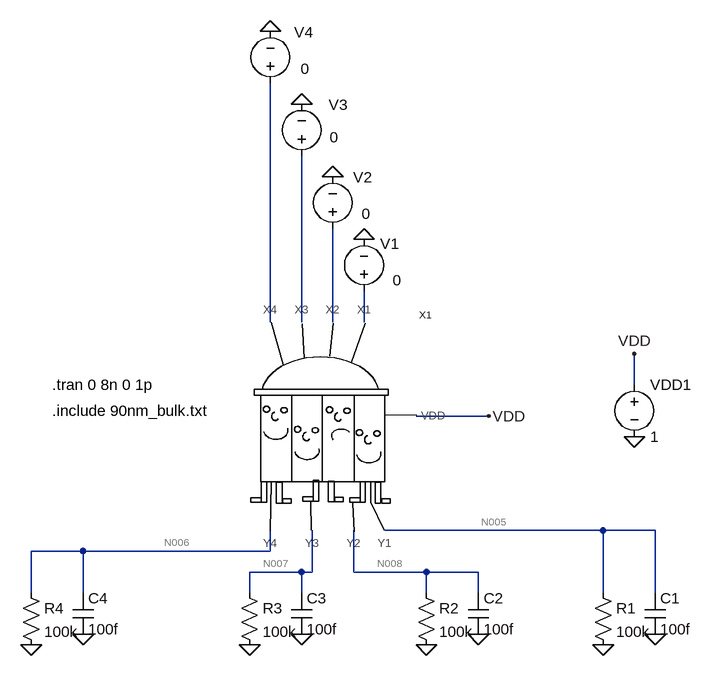
[diagram p0: schematic FUNC_BLOCK_test.asc]
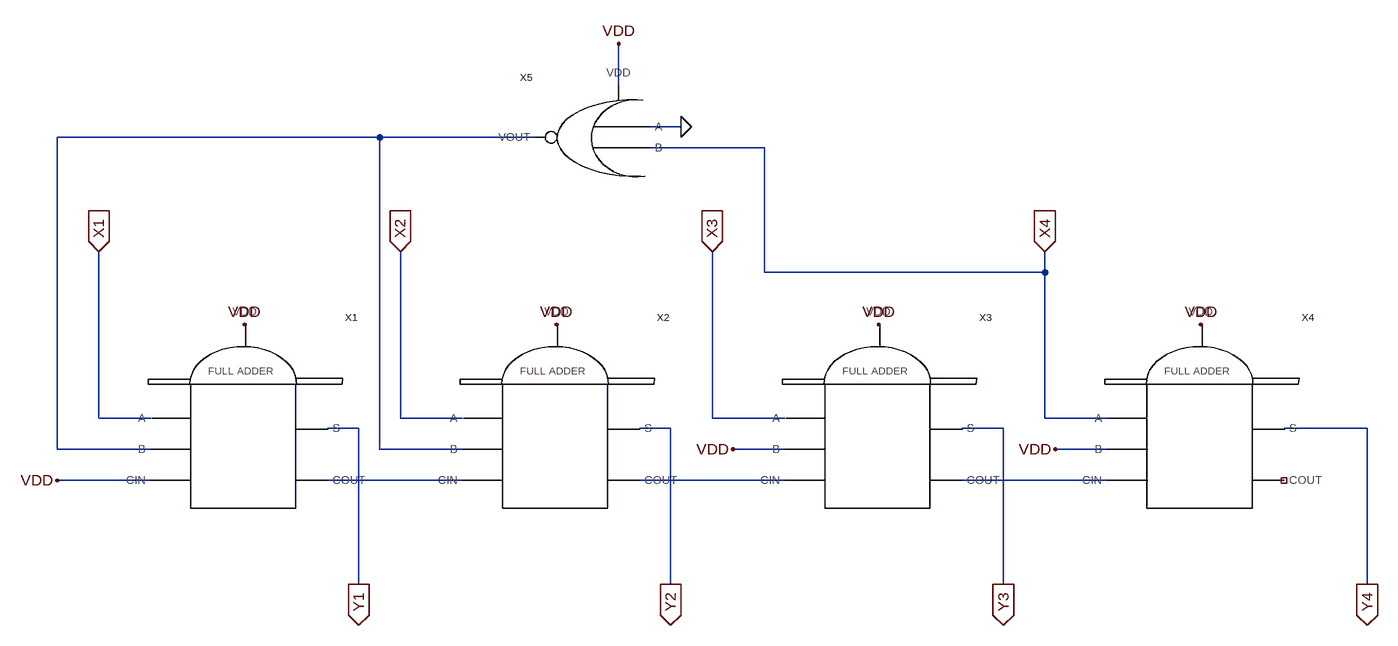
[diagram p1: sub-circuit func_block.asc]
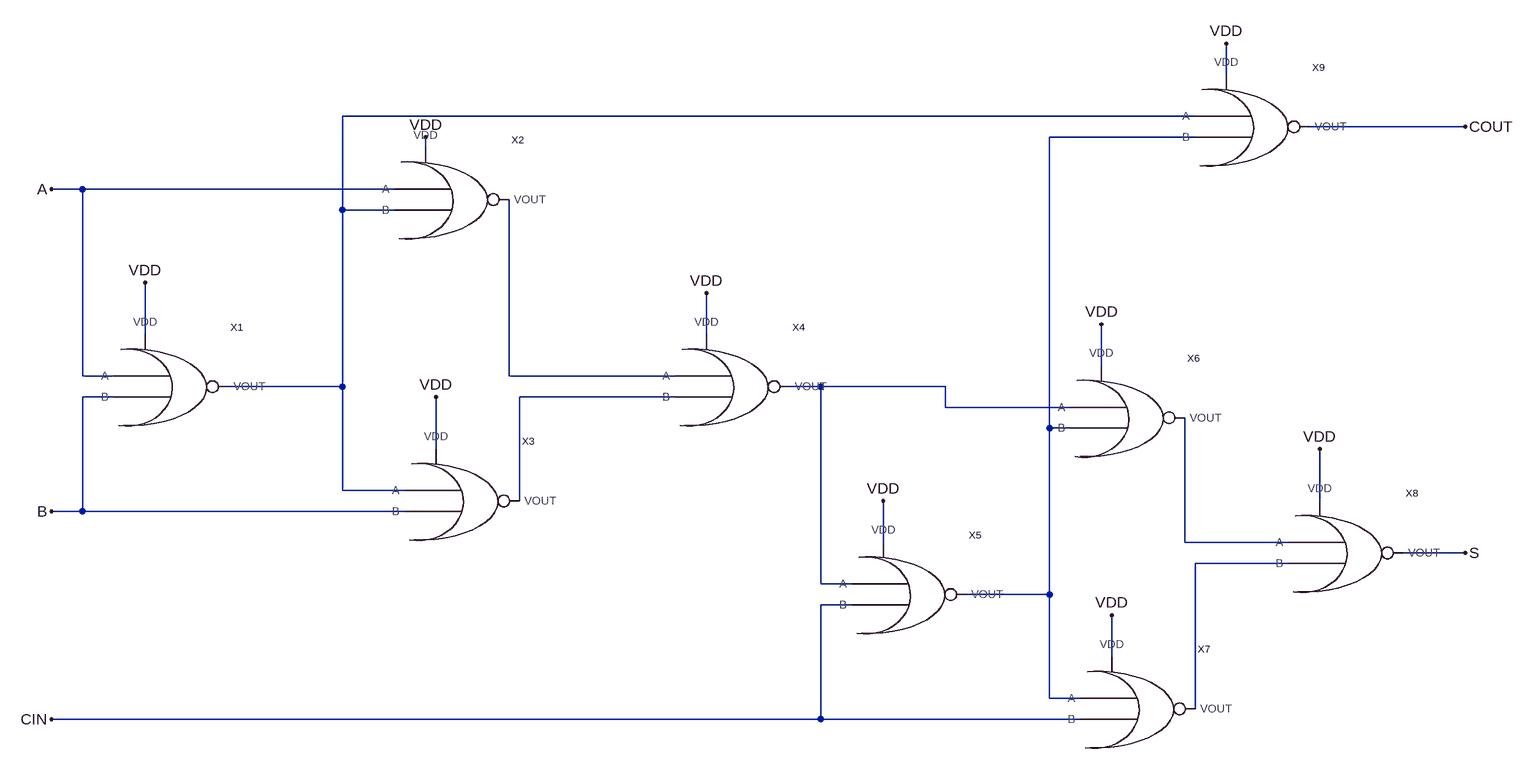
[diagram p2: sub-circuit adder.asc]
FUNC_BLOCK_test.asc, the LTspice schematic file:
Version 4
SHEET 1 880 680
WIRE 112 0 112 -368
WIRE 160 0 160 -256
WIRE 208 0 208 -144
WIRE 256 0 256 -48
WIRE 672 96 672 48
WIRE 448 144 336 144
WIRE 624 320 288 320
WIRE 704 320 624 320
WIRE -176 352 -256 352
WIRE 112 352 112 320
WIRE 112 352 -176 352
WIRE 160 384 80 384
WIRE 176 384 176 320
WIRE 176 384 160 384
WIRE 240 384 240 320
WIRE 352 384 240 384
WIRE 432 384 352 384
WIRE -256 416 -256 352
WIRE -176 416 -176 352
WIRE 80 416 80 384
WIRE 160 416 160 384
WIRE 352 416 352 384
WIRE 432 416 432 384
WIRE 624 416 624 320
WIRE 704 416 704 320
FLAG -256 496 0
FLAG -176 480 0
FLAG 80 496 0
FLAG 160 480 0
FLAG 352 496 0
FLAG 432 480 0
FLAG 624 496 0
FLAG 704 480 0
FLAG 448 144 VDD
FLAG 112 -448 0
FLAG 160 -336 0
FLAG 208 -224 0
FLAG 256 -128 0
FLAG 672 176 0
FLAG 672 48 VDD
SYMBOL FUNC_BLOCK 144 176 R0
SYMATTR InstName X1
SYMBOL res 608 400 R0
SYMATTR InstName R1
SYMATTR Value 100k
SYMBOL res 336 400 R0
SYMATTR InstName R2
SYMATTR Value 100k
SYMBOL res 64 400 R0
SYMATTR InstName R3
SYMATTR Value 100k
SYMBOL res -272 400 R0
SYMATTR InstName R4
SYMATTR Value 100k
SYMBOL cap 688 416 R0
SYMATTR InstName C1
SYMATTR Value 100f
SYMBOL cap 416 416 R0
SYMATTR InstName C2
SYMATTR Value 100f
SYMBOL cap 144 416 R0
SYMATTR InstName C3
SYMATTR Value 100f
SYMBOL cap -192 416 R0
SYMATTR InstName C4
SYMATTR Value 100f
SYMBOL voltage 256 -32 R180
WINDOW 0 -54 89 Left 2
WINDOW 3 -58 33 Left 2
WINDOW 123 0 0 Left 0
WINDOW 39 0 0 Left 0
SYMATTR InstName V1
SYMATTR Value 0
SYMBOL voltage 208 -128 R180
WINDOW 0 -61 95 Left 2
WINDOW 3 -58 39 Left 2
WINDOW 123 0 0 Left 0
WINDOW 39 0 0 Left 0
SYMATTR InstName V2
SYMATTR Value 0
SYMBOL voltage 160 -240 R180
WINDOW 0 -71 95 Left 2
WINDOW 3 -57 45 Left 2
WINDOW 123 0 0 Left 0
WINDOW 39 0 0 Left 0
SYMATTR InstName V3
SYMATTR Value 0
SYMBOL voltage 112 -352 R180
WINDOW 0 -66 94 Left 2
WINDOW 3 -60 38 Left 2
WINDOW 123 0 0 Left 0
WINDOW 39 0 0 Left 0
SYMATTR InstName V4
SYMATTR Value 0
SYMBOL voltage 672 80 R0
WINDOW 123 0 0 Left 0
WINDOW 39 0 0 Left 0
SYMATTR InstName VDD1
SYMATTR Value 1
TEXT -224 96 Left 2 !.tran 0 8n 0 1p
TEXT -224 136 Left 2 !.include 90nm_bulk.txt

func_block.asc, the sub-circuit schematic file:
Version 4
SHEET 1 1608 680
WIRE 384 -624 384 -688
WIRE 480 -560 432 -560
WIRE 16 -544 -480 -544
WIRE 256 -544 16 -544
WIRE 608 -528 432 -528
WIRE 608 -336 608 -528
WIRE 1040 -336 1040 -368
WIRE 1040 -336 608 -336
WIRE -416 -112 -416 -368
WIRE -336 -112 -416 -112
WIRE 48 -112 48 -368
WIRE 144 -112 48 -112
WIRE 528 -112 528 -368
WIRE 640 -112 528 -112
WIRE 1040 -112 1040 -336
WIRE 1136 -112 1040 -112
WIRE -16 -96 -64 -96
WIRE 464 -96 416 -96
WIRE 976 -96 912 -96
WIRE 1536 -96 1408 -96
WIRE -480 -64 -480 -544
WIRE -336 -64 -480 -64
WIRE 16 -64 16 -544
WIRE 144 -64 16 -64
WIRE 640 -64 560 -64
WIRE 1136 -64 1056 -64
WIRE -336 -16 -480 -16
WIRE 144 -16 -64 -16
WIRE 640 -16 416 -16
WIRE 1136 -16 912 -16
WIRE -16 144 -16 -96
WIRE 464 144 464 -96
WIRE 976 144 976 -96
WIRE 1536 144 1536 -96
FLAG -480 -16 VDD
FLAG 560 -64 VDD
FLAG 1056 -64 VDD
FLAG -416 -368 X1
IOPIN -416 -368 In
FLAG 48 -368 X2
IOPIN 48 -368 In
FLAG 528 -368 X3
IOPIN 528 -368 In
FLAG 1040 -368 X4
IOPIN 1040 -368 In
FLAG -16 144 Y1
IOPIN -16 144 Out
FLAG 464 144 Y2
IOPIN 464 144 Out
FLAG 976 144 Y3
IOPIN 976 144 Out
FLAG 1536 144 Y4
IOPIN 1536 144 Out
FLAG 480 -560 0
FLAG 384 -688 VDD
FLAG -192 -256 VDD
FLAG 288 -256 VDD
FLAG 784 -256 VDD
FLAG 1280 -256 VDD
SYMBOL ADDER -192 -64 R0
SYMATTR InstName X1
SYMBOL ADDER 288 -64 R0
SYMATTR InstName X2
SYMBOL ADDER 784 -64 R0
SYMATTR InstName X3
SYMBOL ADDER 1280 -64 R0
SYMATTR InstName X4
SYMBOL NOR 432 -544 M0
SYMATTR InstName X5

adder.asc, the sub-circuit schematic file:
Version 4
SHEET 1 1864 832
WIRE 1408 -240 1408 -288
WIRE 1360 -176 48 -176
WIRE 1776 -160 1536 -160
WIRE 1360 -144 1136 -144
WIRE 176 -128 176 -144
WIRE -352 -64 -400 -64
WIRE 128 -64 -352 -64
WIRE 48 -32 48 -176
WIRE 128 -32 48 -32
WIRE -256 160 -256 80
WIRE 608 160 608 96
WIRE 1216 208 1216 144
WIRE -352 224 -352 -64
WIRE -304 224 -352 224
WIRE 304 224 304 -48
WIRE 560 224 304 224
WIRE 48 240 48 -32
WIRE 48 240 -128 240
WIRE 784 240 736 240
WIRE 976 240 784 240
WIRE -304 256 -352 256
WIRE 560 256 320 256
WIRE 976 272 976 240
WIRE 1168 272 976 272
WIRE 1136 304 1136 -144
WIRE 1168 304 1136 304
WIRE 192 336 192 256
WIRE 48 400 48 240
WIRE 144 400 48 400
WIRE 320 416 320 256
WIRE 1552 416 1552 336
WIRE -352 432 -352 256
WIRE -352 432 -400 432
WIRE 144 432 -352 432
WIRE 880 480 880 416
WIRE 1344 480 1344 288
WIRE 1504 480 1344 480
WIRE 1776 496 1680 496
WIRE 1504 512 1360 512
WIRE 784 544 784 240
WIRE 832 544 784 544
WIRE 1136 560 1136 304
WIRE 1136 560 1008 560
WIRE 832 576 784 576
WIRE 1232 656 1232 592
WIRE 1136 720 1136 560
WIRE 1184 720 1136 720
WIRE 1360 736 1360 512
WIRE 784 752 784 576
WIRE 784 752 -400 752
WIRE 1184 752 784 752
FLAG -256 80 VDD
FLAG 608 96 VDD
FLAG 176 -144 VDD
FLAG 192 256 VDD
FLAG 880 416 VDD
FLAG 1216 144 VDD
FLAG 1408 -288 VDD
FLAG 1552 336 VDD
FLAG 1232 592 VDD
FLAG 1776 496 S
FLAG 1776 -160 COUT
FLAG -400 -64 A
FLAG -400 432 B
FLAG -400 752 CIN
SYMBOL NOR -304 240 R0
SYMATTR InstName X1
SYMBOL NOR 128 -48 R0
SYMATTR InstName X2
SYMBOL NOR 144 416 R0
SYMATTR InstName X3
SYMBOL NOR 560 240 R0
SYMATTR InstName X4
SYMBOL NOR 832 560 R0
SYMATTR InstName X5
SYMBOL NOR 1168 288 R0
SYMATTR InstName X6
SYMBOL NOR 1184 736 R0
SYMATTR InstName X7
SYMBOL NOR 1504 496 R0
SYMATTR InstName X8
SYMBOL NOR 1360 -160 R0
SYMATTR InstName X9

The netlist it stands for:
* FUNC_BLOCK_test.asc
XX1 N001 N002 N003 N004 N006 N007 N008 N005 VDD func_block
R1 N005 0 100k
R2 N008 0 100k
R3 N007 0 100k
R4 N006 0 100k
C1 N005 0 100f
C2 N008 0 100f
C3 N007 0 100f
C4 N006 0 100f
V1 N004 0 0
V2 N003 0 0
V3 N002 0 0
V4 N001 0 0
VDD1 VDD 0 1

* block symbol definitions
.subckt func_block X4 X3 X2 X1 Y4 Y3 Y2 Y1 VDD
XX1 X1 N001 VDD N002 Y1 VDD adder
XX2 X2 N001 N002 N003 Y2 VDD adder
XX3 X3 VDD N003 N004 Y3 VDD adder
XX4 X4 VDD N004 NC_01 Y4 VDD adder
XX5 0 X4 N001 VDD NOR  ; pins A B VOUT VDD
.ends func_block

.subckt adder A B CIN COUT S VDD
XX1 A B N001 VDD NOR  ; pins A B VOUT VDD
XX2 A N001 N003 VDD NOR  ; pins A B VOUT VDD
XX3 N001 B N005 VDD NOR  ; pins A B VOUT VDD
XX4 N003 N005 N004 VDD NOR  ; pins A B VOUT VDD
XX5 N004 CIN N002 VDD NOR  ; pins A B VOUT VDD
XX6 N004 N002 N006 VDD NOR  ; pins A B VOUT VDD
XX7 N002 CIN N007 VDD NOR  ; pins A B VOUT VDD
XX8 N006 N007 S VDD NOR  ; pins A B VOUT VDD
XX9 N001 N002 COUT VDD NOR  ; pins A B VOUT VDD
.ends adder

.tran 0 8n 0 1p
.include 90nm_bulk.txt
.backanno
.end

* Results of the author's LTspice run, read from the files saved beside the schematic
* Operating Point, zero values left out:
*   V(vdd) = 1 V
*   V(n005) = 24.31 µV
*   V(n008) = 24.31 µV
*   V(n007) = 24.31 µV
*   V(n006) = 24.31 µV
*   I(R1) = 243.1 pA
*   I(R2) = 243.1 pA
*   I(R3) = 243.1 pA
*   I(R4) = 243.1 pA
*   I(V1) = 130.9 pA
*   I(V2) = 130.9 pA
*   I(V3) = 130.9 pA
*   I(V4) = 261.7 pA
*   I(Vdd1) = -466.3 nA
*   Ix(x1:X4) = -261.7 pA
*   Ix(x1:X3) = -130.9 pA
*   Ix(x1:X2) = -130.9 pA
*   Ix(x1:X1) = -130.9 pA
*   Ix(x1:Y4) = -243.1 pA
*   Ix(x1:Y3) = -243.1 pA
*   Ix(x1:Y2) = -243.1 pA
*   Ix(x1:Y1) = -243.1 pA
*   Ix(x1:VDD) = 466.3 nA